# EAGLE design 16x2-lcd-breakout-board (EAGLE 7.7.0)
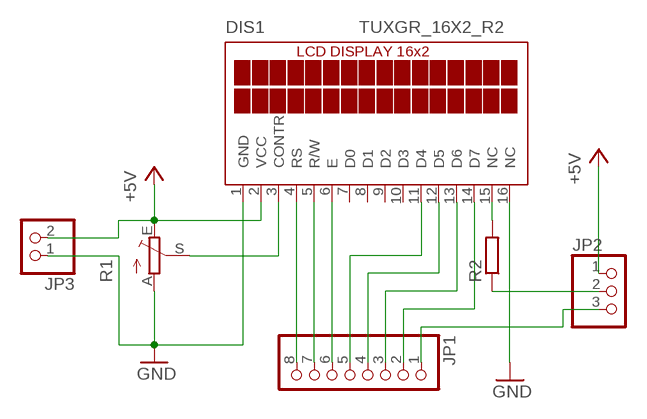
[diagram p0: schematic, sheet 1]

## Parts
DIS1  TUXGR_16X2_R2  [TUXGR_16X2_R2]
JP1  PINHD-1X8  [1X08]
JP2  PINHD-1X3  [1X03]
JP3  PINHD-1X2  [1X02]
R1  TRIM_EU-S63P  [S63P]
R2  R-EU_0207/10  [0207/10]

## Nets
+5V: DIS1.2(VCC) JP2.1 JP3.2 R1.E
GND: DIS1.1(GND) DIS1.16(NC) JP3.1 R1.A
N$1: DIS1.3(CONTR) R1.S
N$2: DIS1.4(RS) JP1.8
N$3: DIS1.5(R/W) JP1.7
N$4: DIS1.6(E) JP1.6
N$5: DIS1.11(D4) JP1.5
N$6: DIS1.12(D5) JP1.4
N$7: DIS1.13(D6) JP1.3
N$8: DIS1.14(D7) JP1.2
N$9: DIS1.15(NC) R2.2
N$10: JP1.1 JP2.3
N$11: JP2.2 R2.1
Unconnected: DIS1.7(D0) DIS1.8(D1) DIS1.9(D2) DIS1.10(D3)

## Library data of the parts
DIS1 = display-lcd:TUXGR_16X2_R2: Tuxgraphics LCD display 16x2 characters reflective, without background light Source: tuxgr_12x2_r2.pdf; OC_FARNELL: unknown; OC_NEWARK: unknown
JP1 = pinhead:PINHD-1X8: PIN HEADER
JP2 = pinhead:PINHD-1X3: PIN HEADER
JP3 = pinhead:PINHD-1X2: PIN HEADER
R1 = pot:TRIM_EU-: POTENTIOMETER
R2 = resistor:R-EU_: RESISTOR, European symbol

## Board
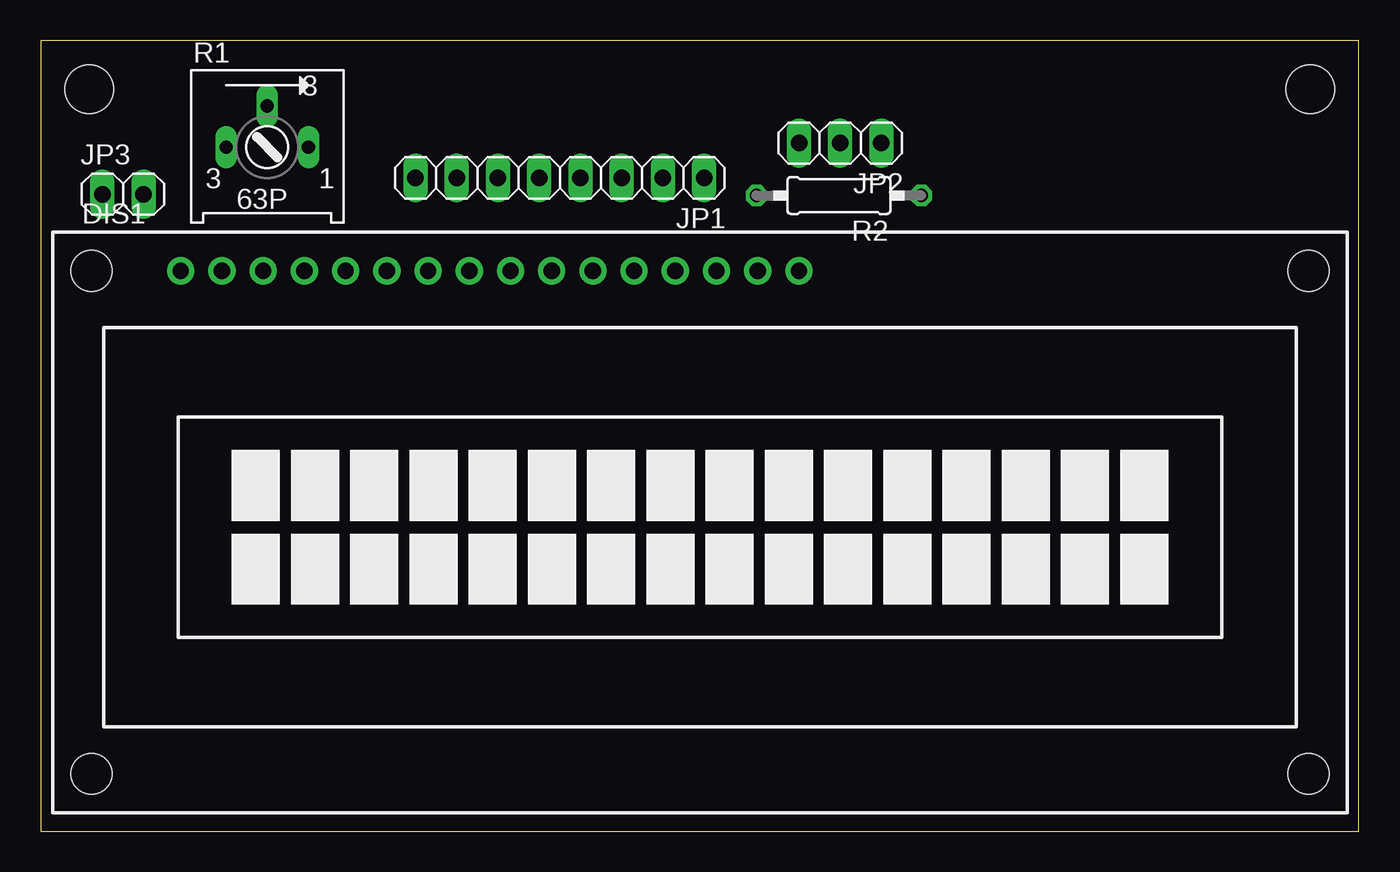
[diagram p1: board, top side]
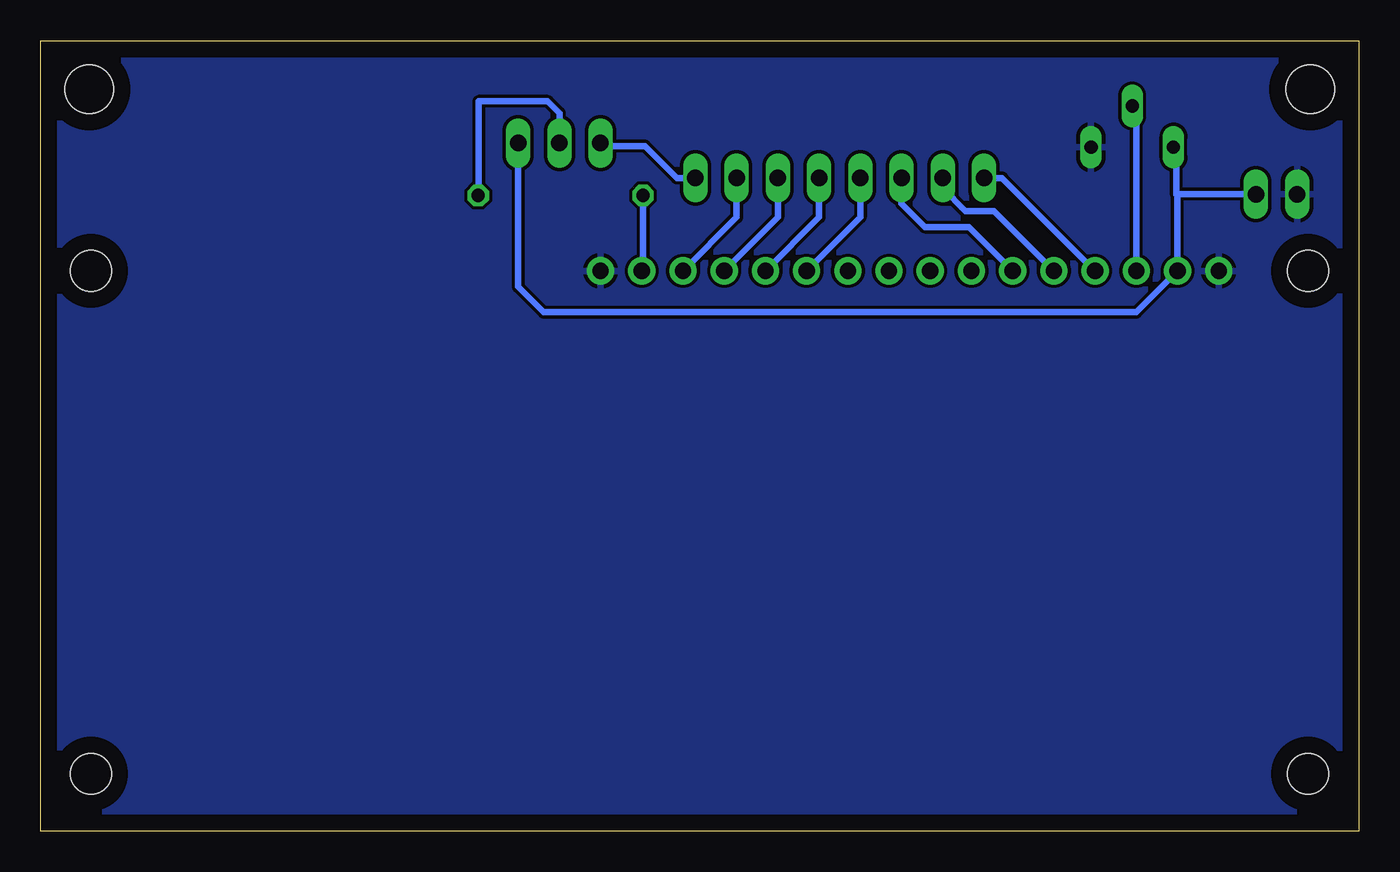
[diagram p2: board, bottom side, seen from below]

Size 81.25 x 48.75 mm. Coordinates in mm from the lower left corner, seen from the top.
Outline: 0,0 81.25,0 81.25,48.75 0,48.75 0,0
Copper layers (1*16): Top 0.035mm / dielectric 1.5mm / Bottom 0.035mm
Design rules "default": minimum track width 10mil, minimum drill 24mil, track to track 8mil, track to pad 8mil, pad to pad 8mil, via to via 8mil, smd to smd 8mil, copper to edge 40mil, drill to drill 8mil, minimum pad ring 10mil, minimum via ring 8mil, stop-mask expansion 4mil, vias tented up to drill 0mil, thermal gap 10mil
Holes 3 mm at 3,45.75 78.25,45.75

### Footprints (pad centres in the part's own frame; a part is rotated, then mirrored left to right if it is on the bottom)
TUXGR_16X2_R2 = drill 1 pad 1.676: 1 -32,15.5; 2 -29.46,15.5; 3 -26.92,15.5; 4 -24.38,15.5; 5 -21.84,15.5; 6 -19.3,15.5; 7 -16.76,15.5; 8 -14.22,15.5; 9 -11.68,15.5; 10 -9.14,15.5; 11 -6.6,15.5; 12 -4.06,15.5; 13 -1.52,15.5; 14 1.02,15.5; 15 3.56,15.5; 16 6.1,15.5 | hole 2.5: -37.5,-15.5; 37.5,-15.5; -37.5,15.5; 37.5,15.5
1X08 = drill 1.016 long: 1 -8.89,0; 2 -6.35,0; 3 -3.81,0; 4 -1.27,0; 5 1.27,0; 6 3.81,0; 7 6.35,0; 8 8.89,0
1X03 = drill 1.016 long: 1 -2.54,0; 2 0,0; 3 2.54,0
1X02 = drill 1.016 long: 1 -1.27,0; 2 1.27,0
S63P = drill 0.813 long: A 2.54,0; E -2.54,0; S 0,2.54
0207/10 = drill 0.813 octagon: 1 -5.08,0; 2 5.08,0

### Placement (x,y rotation side)
DIS1  40.64,19.05 0 top
JP1  32,40.28 180 top
JP2  49.28,42.43 180 top
JP3  5.08,39.28 0 top
R1  13.97,42.18 0 top
R2  49.2,39.2 180 top

### Tracks (layer width: path | path; a pad name or v marks a point on that pad's centre or on a via)
+5V
  Bottom 0.406: JP3.2 11.22,39.28 11.25,39.25 | 11.25,39.25 11.25,42 R1.E | 11.25,39.25 11.18,39.18 DIS1.2 13.73,32 50.25,32 51.82,33.57 JP2.1
GND
  pour Bottom: 0,48.75 81.5,48.75 81.5,-0.25 0,-0.25
N$1
  Bottom 0.406: DIS1.3 13.72,44.47 R1.S
N$2
  Bottom 0.406: JP1.8 21.99,40.28 DIS1.4
N$3
  Bottom 0.406: JP1.7 25.65,39.65 24.25,38.25 22.5,38.25 DIS1.5
N$4
  Bottom 0.406: JP1.6 28.19,38.69 26.75,37.25 24.04,37.25 DIS1.6
N$5
  Bottom 0.406: JP1.5 30.73,37.86 DIS1.11
N$6
  Bottom 0.406: JP1.4 33.27,37.86 DIS1.12
N$7
  Bottom 0.406: JP1.3 35.81,37.86 DIS1.13
N$8
  Bottom 0.406: JP1.2 38.35,37.86 DIS1.14
N$9
  Bottom 0.406: R2.2 44.12,34.63 DIS1.15
N$10
  Bottom 0.406: JP1.1 42.03,40.28 44,42.25 46.56,42.25 JP2.3
N$11
  Bottom 0.406: JP2.2 49.28,44.28 50,45 54.25,45 54.25,39.23 R2.1